# Altium project STM32F4.PrjPCB
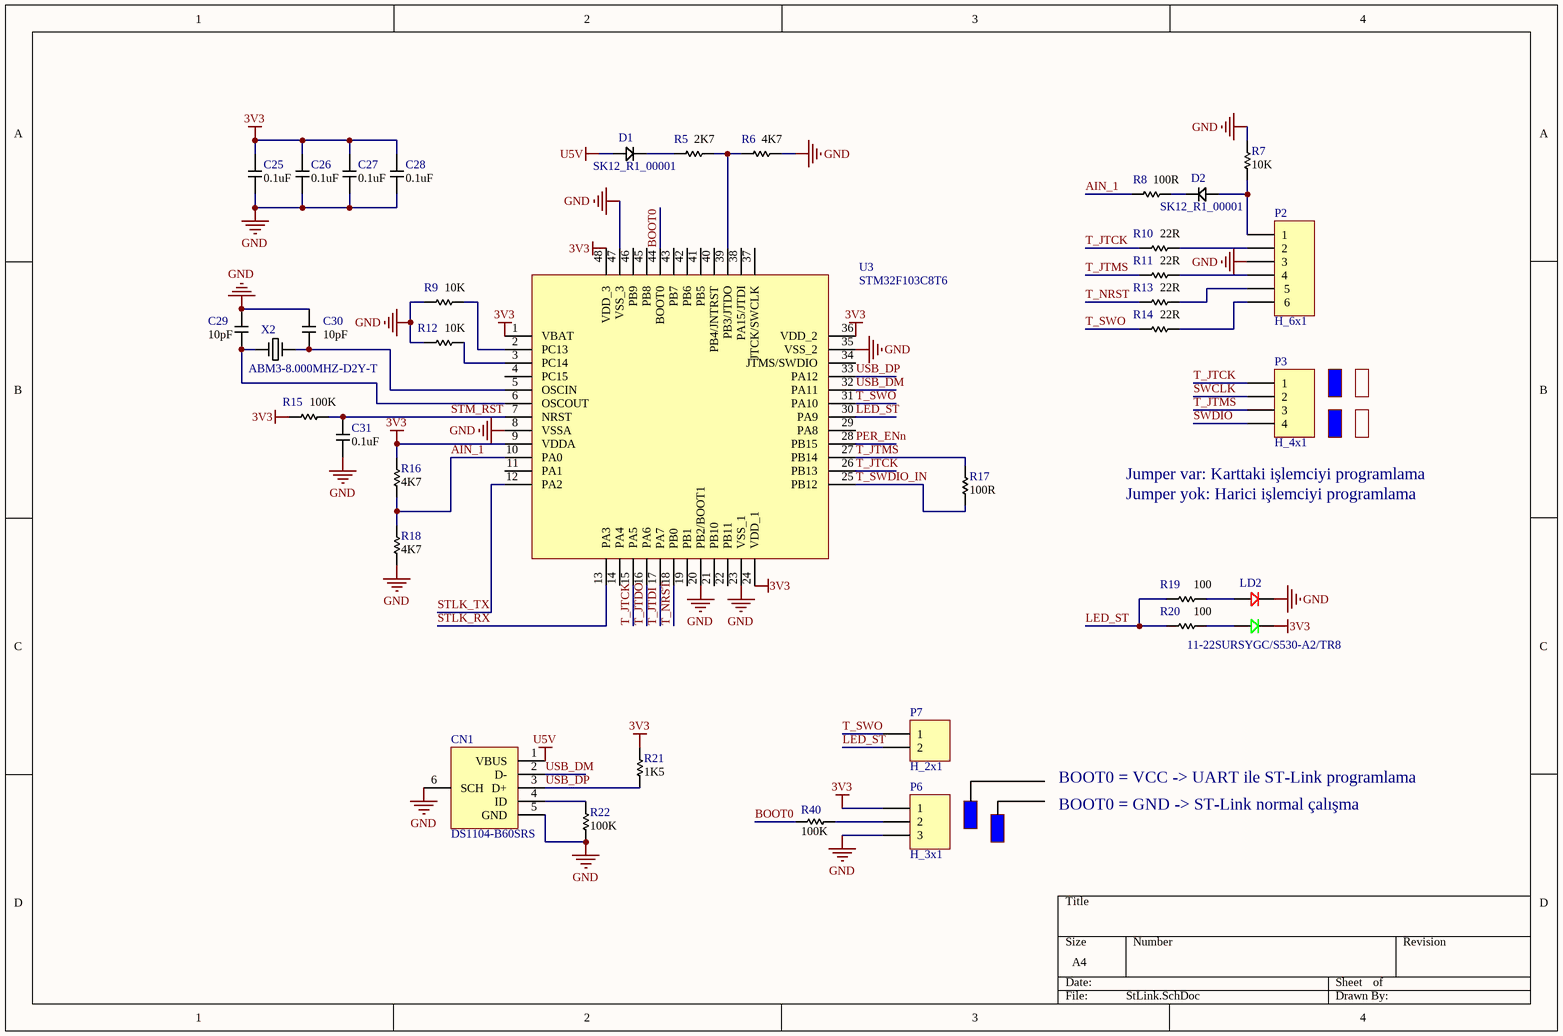
[diagram p0: StLink.SchDoc]
4 sheets, 97 parts. Net scope: global (net labels, ports and power ports of the same name join across sheets).
Board file: PCB.PcbDoc
Sheets:
  StLink.SchDoc
  MCU.SchDoc
  Power.SchDoc
  UserComponents.SchDoc

## Sheet StLink.SchDoc
size A4

### Parts
C25  value 0.1uF  [Kemet_0805_X7R]  (hidden comment: C0805C104K3RACTU)
C26  value 0.1uF  [Kemet_0805_X7R]  (hidden comment: C0805C104K3RACTU)
C27  value 0.1uF  [Kemet_0805_X7R]  (hidden comment: C0805C104K3RACTU)
C28  value 0.1uF  [Kemet_0805_X7R]  (hidden comment: C0805C104K3RACTU)
C29  value 10pF  [Kemet_0805_X7R]  (hidden comment: C0805C104K3RACTU)
C30  value 10pF  [Kemet_0805_X7R]  (hidden comment: C0805C104K3RACTU)
C31  value 0.1uF  [Kemet_0805_X7R]  (hidden comment: C0805C104K3RACTU)
CN1  DS1104-B60SRS  [Connfly_DS1104-B60SRS]
D1  SK12_R1_00001  [Panjit_DO214AA_2]
D2  SK12_R1_00001  [Panjit_DO214AA_2]
LD2  11-22SURSYGC/S530-A2/TR8  [Everlight_11-22SURSYGC]
P2  H_6x1  [HEADER_HDRV6W65P254_6X1_1524X254H945]
P3  H_4x1  [HEADER_HDRV4W65P254_4X1_1016X254H945]
P6  H_3x1  [HEADER_HDRV3W65P254_3X1_762X254H945]
P7  H_2x1  [HEADER_HDRV2W65P254_2X1_508X254H945]
R5  value 2K7  [VISHAY_RESC205X125X50L35_30N]  (hidden comment: CRCW08050000Z0EA)
R6  value 4K7  [VISHAY_RESC205X125X50L35_30N]  (hidden comment: CRCW08050000Z0EA)
R7  value 10K  [VISHAY_RESC205X125X50L35_30N]  (hidden comment: CRCW08050000Z0EA)
R8  value 100R  [VISHAY_RESC205X125X50L35_30N]  (hidden comment: CRCW08050000Z0EA)
R9  value 10K  [VISHAY_RESC205X125X50L35_30N]  (hidden comment: CRCW08050000Z0EA)
R10  value 22R  [VISHAY_RESC205X125X50L35_30N]  (hidden comment: CRCW08050000Z0EA)
R11  value 22R  [VISHAY_RESC205X125X50L35_30N]  (hidden comment: CRCW08050000Z0EA)
R12  value 10K  [VISHAY_RESC205X125X50L35_30N]  (hidden comment: CRCW08050000Z0EA)
R13  value 22R  [VISHAY_RESC205X125X50L35_30N]  (hidden comment: CRCW08050000Z0EA)
R14  value 22R  [VISHAY_RESC205X125X50L35_30N]  (hidden comment: CRCW08050000Z0EA)
R15  value 100K  [VISHAY_RESC205X125X50L35_30N]  (hidden comment: CRCW08050000Z0EA)
R16  value 4K7  [VISHAY_RESC205X125X50L35_30N]  (hidden comment: CRCW08050000Z0EA)
R17  value 100R  [VISHAY_RESC205X125X50L35_30N]  (hidden comment: CRCW08050000Z0EA)
R18  value 4K7  [VISHAY_RESC205X125X50L35_30N]  (hidden comment: CRCW08050000Z0EA)
R19  value 100  [VISHAY_RESC205X125X50L35_30N]  (hidden comment: CRCW08050000Z0EA)
R20  value 100  [VISHAY_RESC205X125X50L35_30N]  (hidden comment: CRCW08050000Z0EA)
R21  value 1K5  [VISHAY_RESC205X125X50L35_30N]  (hidden comment: CRCW08050000Z0EA)
R22  value 100K  [VISHAY_RESC205X125X50L35_30N]  (hidden comment: CRCW08050000Z0EA)
R40  value 100K  [VISHAY_RESC205X125X50L35_30N]  (hidden comment: CRCW08050000Z0EA)
U3  STM32F103C8T6  [STM_QFP48P50_900X900X160L60X22N]
X2  ABM3-8.000MHZ-D2Y-T  [ABRACON_XTALDFN2_500X320X130L130X200N]

### Nets
3V3: C25.2 C26.2 C27.2 C28.2 LD2.4(G-) P6.1 R15.1 R16.2 R21.2 U3.1(VBAT) U3.9(VDDA) U3.24(VDD_1) U3.36(VDD_2) U3.48(VDD_3)
GND: C25.1 C26.1 C27.1 C28.1 C29.2 C30.2 C31.1 CN1.5(GND) CN1.6(SCH) LD2.2(R-) P2.3 P6.3 R6.2 R7.2 R9.1 R12.1 R18.1 R22.2 U3.8(VSSA) U3.20(PB2/BOOT1) U3.23(VSS_1) U3.35(VSS_2) U3.47(VSS_3)
U5V: CN1.1(VBUS) D1.1(A)
AIN_1: R8.2 R16.1 R18.2 U3.10(PA0)
BOOT0: R40.2 U3.44(BOOT0)
LED_ST: P7.2 R19.2 R20.2 U3.30(PA9)
PER_ENn: U3.28(PB15)
STLK_RX: U3.13(PA3)
STLK_TX: U3.12(PA2)
STM_RST: C31.2 R15.2 U3.7(NRST)
SWCLK: P3.2
SWDIO: P3.4
T_JTCK: P3.1 R10.2 U3.15(PA5) U3.26(PB13)
T_JTDI: U3.17(PA7)
T_JTDO: U3.16(PA6)
T_JTMS: P3.3 R11.2 R17.1 U3.27(PB14)
T_NRST: R13.2 U3.18(PB0)  [project net NRST]
T_SWDIO_IN: R17.2 U3.25(PB12)
T_SWO: P7.1 R14.2 U3.31(PA10)
USB_DM: CN1.2(D-) U3.32(PA11)
USB_DP: CN1.3(D+) R21.1 U3.33(PA12)
NetC29_1: C29.1 U3.6(OSCOUT) X2.1
NetC30_1: C30.1 U3.5(OSCIN) X2.2
NetCN1_4: CN1.4(ID) R22.1
NetD1_2: D1.2(C) R5.1
NetD2_1: D2.1(A) P2.1 R7.1
NetD2_2: D2.2(C) R8.1
NetLD2_1: LD2.1(R+) R19.1
NetLD2_3: LD2.3(G+) R20.1
NetP2_2: P2.2 R10.1
NetP2_4: P2.4 R11.1
NetP2_5: P2.5 R13.1
NetP2_6: P2.6 R14.1
NetP6_2: P6.2 R40.1
NetR5_2: R5.2 R6.1 U3.39(PB3/JTDO)
NetR9_2: R9.2 U3.2(PC13)
NetR12_2: R12.2 U3.3(PC14)

Not connected (* = marked no-connect by the designer): U3 4(PC15) 11(PA1) 14(PA4) 19(PB1) 21(PB10) 22(PB11) 29(PA8) 34(JTMS/SWDIO) 37(JTCK/SWCLK) 38(PA15/JTDI) 40(PB4/JNTRST) 41(PB5) 42(PB6) 43(PB7) 45(PB8) 46(PB9)

### Notes on the sheet
- (near P3) Jumper var: Karttaki işlemciyi programlama
- Jumper yok: Harici işlemciyi programlama
- BOOT0 = VCC -> UART ile ST-Link programlama
- BOOT0 = GND -> ST-Link normal çalışma

### Library data of the parts
C25-C31 = C0805C104K3RACTU: Cap_0805_0.1uF_25VDC_Kemet; Manufacturer: Kemet; Voltage: 25VDC; Tolerance: 10%; Dimensions: 2x1.25x0.9; Mounting Type: SMT; Package: 0805; Purchase Link: https://www.ozdisan.com/pasif-komponentler/kondansatorler/smd-kondansatorler-mlcc/C0805C105K4RACTU
CN1 = DS1104-B60SRS: UsbConn_Mini_5Pin_SMT_Connfly
D1 D2 = SK12_R1_00001: Schottky_1A_0.6V_20V_Panjit; Manufacturer: Panjit; Forward Current: 1A; Forward Voltage: 0.6V; Reverse Voltage: 20V; Package: DO214AA; Dimensions: -; Mounting Type: SMD; Purchase Link: https://www.ozdisan.com/guc-yari-iletkenleri/diyot-modul-diyot-dogrultucular/schottky-diyotlar/SK12R100001
LD2 = 11-22SURSYGC/S530-A2/TR8: Led_RG_1.7-2.4V_25mA_Everlight; Forward Current: 25mA; Color: RG; Manufacturer: Everlight; Forward Voltage: 1.7-2.4V; Package: 1206; Dimensions: -; Mounting Type: SMT; Purchase Link: https://www.ozdisan.com/led-led-aydinlatma-cozumleri/led-komponentler/renkli-led-sinyal/11-22SURSYGCS530-A2TR8
P2 = H_6x1: Head_6x1_2.54; Pitch: 2.54mm; Position of Pins: V; Manufacturer: -; Number of Pins: 6x1; Mounting Type: TH; Purchase Link: -; Dimensions: -
P3 = H_4x1: Head_4x1_2.54; Pitch: 2.54mm; Position of Pins: V; Manufacturer: -; Number of Pins: 4x1; Mounting Type: TH; Purchase Link: -; Dimensions: -
P6 = H_3x1: Head_3x1_2.54; Pitch: 2.54mm; Position of Pins: V; Manufacturer: -; Number of Pins: 3x1; Mounting Type: TH; Purchase Link: -; Dimensions: -
P7 = H_2x1: Head_2x1_2.54; Pitch: 2.54mm; Position of Pins: V; Manufacturer: -; Number of Pins: 2x1; Mounting Type: TH; Purchase Link: -; Dimensions: -
R5-R22 R40 = CRCW08050000Z0EA: Res_0805_0R_1/8W_Vishay; Manufacturer: Vishay; Power: 1/8W; Tolerance: Jumper; Dimensions: 2x1.25x0.45; Mounting Type: SMT; Package: 0805; Purchase Link: https://www.ozdisan.com/pasif-komponentler/direncler/smt-smd-direncler/CRCW08050000Z0EA
U3 = STM32F103C8T6: Microcontroller_STM; Manufacturer: STM; Purchase Link: https://ozdisan.com/entegre-devreler-ics/embedded-entegre-devreler/ic-mikroislemciler/STM32F103C8T6; Mounting Type: SMT; Package: LQFP48
X2 = ABM3-8.000MHZ-D2Y-T: Crystal_8MHz_18pF_140R_20PPM_30PPM_Abracon; Load Capacitance: 18pF; ESR: 140R; Frequency Stability: 30PPM; Frequency Tolerance: 20PPM; Frequency: 8MHz; Manufacturer: Abracon; Dimensions: 5x3.2x1.3; Package: ABM3; Mounting Type: SMT; Purchase Link: https://www.ozdisan.com/pasif-komponentler/kristaller-osilatorler-rezanatorler/kristal/ABM3-8-000MHZ-D2Y-T

## Sheet MCU.SchDoc
size A4
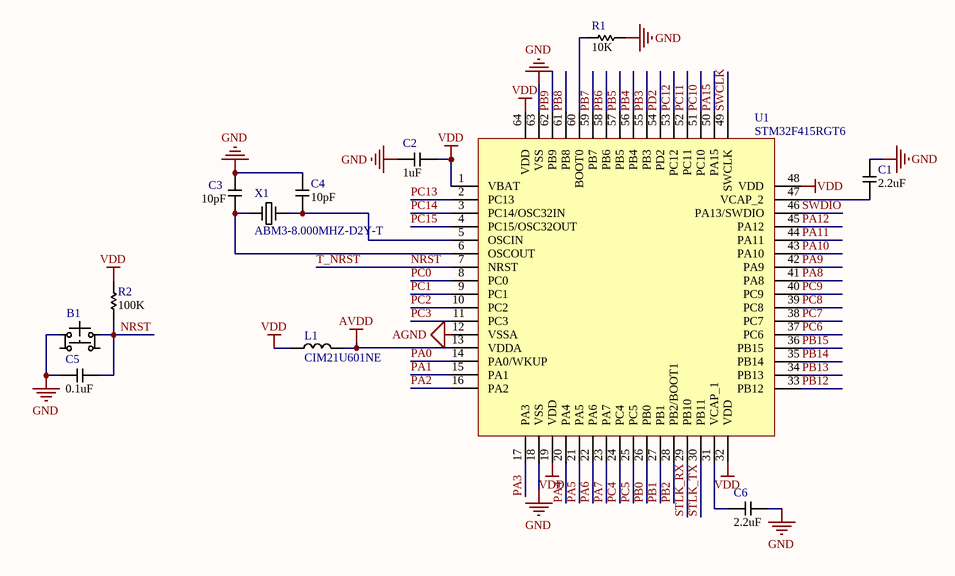
[diagram p1: MCU.SchDoc]

### Parts
B1  DTSM-65R-V-T/R  [Diptronics_DTSM-65_Red_4]  (value not drawn)
C1  value 2.2uF  [Kemet_0805_X7R]  (hidden comment: C0805C104K3RACTU)
C2  value 1uF  [Kemet_0805_X7R]  (hidden comment: C0805C105K4RACTU)
C3  value 10pF  [Kemet_0805_X7R]  (hidden comment: C0805C104K3RACTU)
C4  value 10pF  [Kemet_0805_X7R]  (hidden comment: C0805C104K3RACTU)
C5  value 0.1uF  [Kemet_0805_X7R]  (hidden comment: C0805C104K3RACTU)
C6  value 2.2uF  [Kemet_0805_X7R]  (hidden comment: C0805C104K3RACTU)
L1  CIM21U601NE  [SAMSUNG_INDC200X125X110L45N]
R1  value 10K  [VISHAY_RESC205X125X50L35_30N]  (hidden comment: CRCW08050000Z0EA)
R2  value 100K  [VISHAY_RESC205X125X50L35_30N]  (hidden comment: CRCW08050000Z0EA)
U1  STM32F415RGT6  [STM_QFP64P50_1200X1200X160L60X22N]
X1  ABM3-8.000MHZ-D2Y-T  [ABRACON_XTALDFN2_500X320X130L130X200N]

### Nets
AGND: U1.12(VSSA)
AVDD: L1.2 U1.13(VDDA)
GND: B1.1 C1.1 C2.1 C3.2 C4.2 C5.1 C6.1 R1.1 U1.18(VSS) U1.63(VSS)
VDD: C2.2 L1.1 R2.1 U1.1(VBAT) U1.19(VDD) U1.32(VDD) U1.48(VDD) U1.64(VDD)
NRST: B1.3 C5.2 R2.2 U1.7(NRST)  [also labelled T_NRST]
PA0: U1.14(PA0/WKUP)
PA1: U1.15(PA1)
PA2: U1.16(PA2)
PA3: U1.17(PA3)
PA4: U1.20(PA4)
PA5: U1.21(PA5)
PA6: U1.22(PA6)
PA7: U1.23(PA7)
PA8: U1.41(PA8)
PA9: U1.42(PA9)
PA10: U1.43(PA10)
PA11: U1.44(PA11)
PA12: U1.45(PA12)
PA15: U1.50(PA15)
PB0: U1.26(PB0)
PB1: U1.27(PB1)
PB2: U1.28(PB2/BOOT1)
PB3: U1.55(PB3)
PB4: U1.56(PB4)
PB5: U1.57(PB5)
PB6: U1.58(PB6)
PB7: U1.59(PB7)
PB8: U1.61(PB8)
PB9: U1.62(PB9)
PB12: U1.33(PB12)
PB13: U1.34(PB13)
PB14: U1.35(PB14)
PB15: U1.36(PB15)
PC0: U1.8(PC0)
PC1: U1.9(PC1)
PC2: U1.10(PC2)
PC3: U1.11(PC3)
PC4: U1.24(PC4)
PC5: U1.25(PC5)
PC6: U1.37(PC6)
PC7: U1.38(PC7)
PC8: U1.39(PC8)
PC9: U1.40(PC9)
PC10: U1.51(PC10)
PC11: U1.52(PC11)
PC12: U1.53(PC12)
PC13: U1.2(PC13)
PC14: U1.3(PC14/OSC32IN)
PC15: U1.4(PC15/OSC32OUT)
PD2: U1.54(PD2)
STLK_RX: U1.29(PB10)
STLK_TX: U1.30(PB11)
SWCLK: U1.49(SWCLK)
SWDIO: U1.46(PA13/SWDIO)
NetC1_2: C1.2 U1.47(VCAP_2)
NetC3_1: C3.1 U1.6(OSCOUT) X1.1
NetC4_1: C4.1 U1.5(OSCIN) X1.2
NetC6_2: C6.2 U1.31(VCAP_1)
NetR1_2: R1.2 U1.60(BOOT0)

Not connected (* = marked no-connect by the designer): B1 2 4

### Library data of the parts
B1 = DTSM-65R-V-T/R: Button_SMD_4_6x6x9.5_Diptronics; Dimensions: 6x6x9.5; Mounting Type: SMT; Manufacturer: Diptronics; Purchase Link: https://www.ozdisan.com/elektromekanik-komponentler/sivicler-anahtarlar/tact-sivicler/DTSM-65R-V-TR; Package: DTSM-65; Number of Pins: 4; Color: Red
C1 C3-C6 = C0805C104K3RACTU: as C25 on sheet StLink; Dimensions: 2x1.25x0.9; Mounting Type: SMT; Package: 0805; Purchase Link: https://www.ozdisan.com/pasif-komponentler/kondansatorler/smd-kondansatorler-mlcc/C0805C105K4RACTU
C2 = C0805C105K4RACTU: Cap_0805_1uF_16VDC_Kemet; Manufacturer: Kemet; Voltage: 16VDC; Tolerance: 2%; Dimensions: 2x1.25x0.9; Mounting Type: SMT; Package: 0805; Purchase Link: https://www.ozdisan.com/pasif-komponentler/kondansatorler/smd-kondansatorler-mlcc/C0805C105K4RACTU
L1 = CIM21U601NE: Bead_600R_500mA_0805_Samsung; Manufacturer: Samsung; Mounting Type: SMT; Package: 0805; Purchase Link: https://ozdisan.com/Product/Detail/406952/CIM21U601NE
R1 R2 = CRCW08050000Z0EA: as R5 on sheet StLink; Dimensions: 2x1.25x0.45; Mounting Type: SMT; Package: 0805; Purchase Link: https://www.ozdisan.com/pasif-komponentler/direncler/smt-smd-direncler/CRCW08050000Z0EA
U1 = STM32F415RGT6: Microcontroller_STM; Manufacturer: STM; Package: LQFP64; Mounting Type: SMT; Purchase Link: https://ozdisan.com/Product/Detail/483733/STM32F415RGT6
X1 = ABM3-8.000MHZ-D2Y-T: as X2 on sheet StLink; Manufacturer: Abracon; Dimensions: 5x3.2x1.3; Package: ABM3; Mounting Type: SMT; Purchase Link: https://www.ozdisan.com/pasif-komponentler/kristaller-osilatorler-rezanatorler/kristal/ABM3-8-000MHZ-D2Y-T

## Sheet Power.SchDoc
size A4
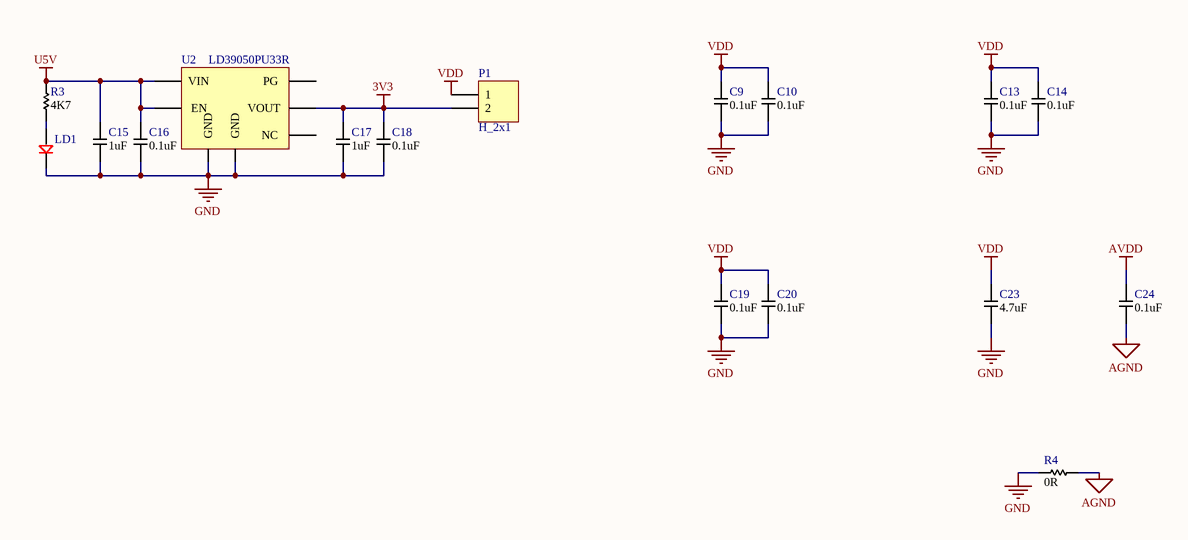
[diagram p2: Power.SchDoc]

### Parts
C9  value 0.1uF  [Kemet_0805_X7R]  (hidden comment: C0805C104K3RACTU)
C10  value 0.1uF  [Kemet_0805_X7R]  (hidden comment: C0805C104K3RACTU)
C13  value 0.1uF  [Kemet_0805_X7R]  (hidden comment: C0805C104K3RACTU)
C14  value 0.1uF  [Kemet_0805_X7R]  (hidden comment: C0805C104K3RACTU)
C15  value 1uF  [Kemet_0805_X7R]  (hidden comment: C0805C105K4RACTU)
C16  value 0.1uF  [Kemet_0805_X7R]  (hidden comment: C0805C104K3RACTU)
C17  value 1uF  [Kemet_0805_X7R]  (hidden comment: C0805C105K4RACTU)
C18  value 0.1uF  [Kemet_0805_X7R]  (hidden comment: C0805C104K3RACTU)
C19  value 0.1uF  [Kemet_0805_X7R]  (hidden comment: C0805C104K3RACTU)
C20  value 0.1uF  [Kemet_0805_X7R]  (hidden comment: C0805C104K3RACTU)
C23  value 4.7uF  [Kemet_0805_X7R]  (hidden comment: C0805C104K3RACTU)
C24  value 0.1uF  [Kemet_0805_X7R]  (hidden comment: C0805C104K3RACTU)
LD1  17-21/R6C-AP1Q2L/3T  [Everlight_17-21]  (value not drawn)
P1  H_2x1  [HEADER_HDRV2W65P254_2X1_508X254H945]
R3  value 4K7  [VISHAY_RESC205X125X50L35_30N]  (hidden comment: CRCW08050000Z0EA)
R4  value 0R  [VISHAY_RESC205X125X50L35_30N]  (hidden comment: CRCW08050000Z0EA)
U2  LD39050PU33R  [TI_SON7P95_300X300X100L40X34T236X162N]

### Nets
3V3: C17.2 C18.2 P1.2 U2.4(VOUT)
AGND: C24.1 R4.1
AVDD: C24.2
GND: C9.1 C10.1 C13.1 C14.1 C15.1 C16.1 C17.1 C18.1 C19.1 C20.1 C23.1 LD1.2(R-) R4.2 U2.2(GND) U2.7(GND)
U5V: C15.2 C16.2 R3.2 U2.1(EN) U2.6(VIN)
VDD: C9.2 C10.2 C13.2 C14.2 C19.2 C20.2 C23.2 P1.1
NetLD1_1: LD1.1(R+) R3.1

Not connected (* = marked no-connect by the designer): U2 3(PG) 5(NC)

### Library data of the parts
C9 C10 C13 C14 C16 C18-C20 C23 C24 = C0805C104K3RACTU: as C25 on sheet StLink; Dimensions: 2x1.25x0.9; Mounting Type: SMT; Package: 0805; Purchase Link: https://www.ozdisan.com/pasif-komponentler/kondansatorler/smd-kondansatorler-mlcc/C0805C105K4RACTU
C15 C17 = C0805C105K4RACTU: as C2 on sheet MCU; Dimensions: 2x1.25x0.9; Mounting Type: SMT; Package: 0805; Purchase Link: https://www.ozdisan.com/pasif-komponentler/kondansatorler/smd-kondansatorler-mlcc/C0805C105K4RACTU
LD1 = 17-21/R6C-AP1Q2L/3T: Led_R_1.7V_25mA_Everlight; Forward Current: 25mA; Forward Voltage: 1.7V; Color: R; Manufacturer: Everlight; Package: 0805; Dimensions: -; Mounting Type: SMT; Purchase Link: https://www.ozdisan.com/led-led-aydinlatma-cozumleri/led-komponentler/renkli-led-sinyal/17-21R6C-AP1Q2L3T
P1 = H_2x1: as P7 on sheet StLink; Manufacturer: -; Number of Pins: 2x1; Mounting Type: TH; Purchase Link: -; Dimensions: -
R3 R4 = CRCW08050000Z0EA: as R5 on sheet StLink; Dimensions: 2x1.25x0.45; Mounting Type: SMT; Package: 0805; Purchase Link: https://www.ozdisan.com/pasif-komponentler/direncler/smt-smd-direncler/CRCW08050000Z0EA
U2 = LD39050PU33R: LinReg_3.3V_500mA_200mV_ST; Manufacturer: ST; Output Voltage: 3.3V; Output Current: 500mA; Dropout Voltage: 200mV; Dimensions: -; Package: DFN6(3x3); Mounting Type: SMT; Purchase Link: https://www.ozdisan.com/entegre-devreler-ics/guc-entegreleri/ic-lineer-voltaj-regulatorleri/LD39050PU33R

## Sheet UserComponents.SchDoc
size A4
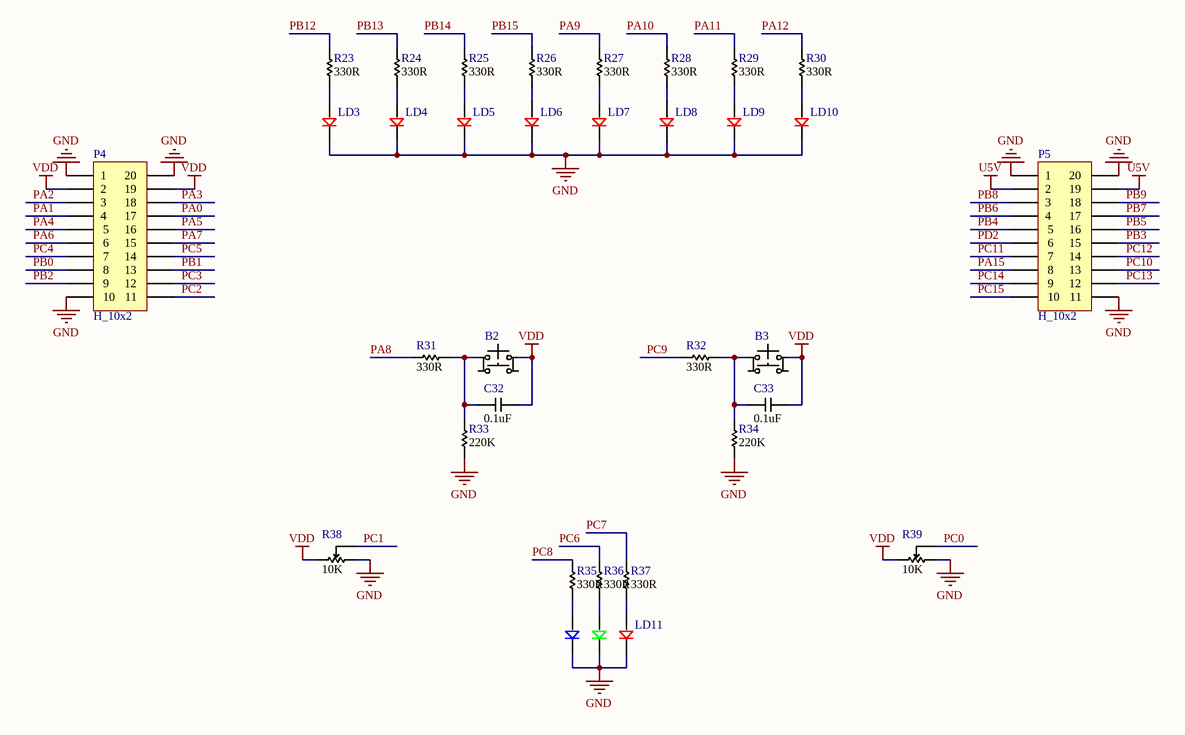
[diagram p3: UserComponents.SchDoc]

### Parts
B2  DTSM-65R-V-T/R  [Diptronics_DTSM-65_Red_4]  (value not drawn)
B3  DTSM-65R-V-T/R  [Diptronics_DTSM-65_Red_4]  (value not drawn)
C32  value 0.1uF  [Kemet_0805_X7R]  (hidden comment: C0805C104K3RACTU)
C33  value 0.1uF  [Kemet_0805_X7R]  (hidden comment: C0805C104K3RACTU)
LD3  17-21/R6C-AP1Q2L/3T  [Everlight_17-21]  (value not drawn)
LD4  17-21/R6C-AP1Q2L/3T  [Everlight_17-21]  (value not drawn)
LD5  17-21/R6C-AP1Q2L/3T  [Everlight_17-21]  (value not drawn)
LD6  17-21/R6C-AP1Q2L/3T  [Everlight_17-21]  (value not drawn)
LD7  17-21/R6C-AP1Q2L/3T  [Everlight_17-21]  (value not drawn)
LD8  17-21/R6C-AP1Q2L/3T  [Everlight_17-21]  (value not drawn)
LD9  17-21/R6C-AP1Q2L/3T  [Everlight_17-21]  (value not drawn)
LD10  17-21/R6C-AP1Q2L/3T  [Everlight_17-21]  (value not drawn)
LD11  HLAF5060H248BS36FU76GCS1  [Honglitronic_5050]  (value not drawn)
P4  H_10x2  [HEADER_HDRV20W65P254_10X2_2540X508H945]
P5  H_10x2  [HEADER_HDRV20W65P254_10X2_2540X508H945]
R23  value 330R  [VISHAY_RESC205X125X50L35_30N]  (hidden comment: CRCW08050000Z0EA)
R24  value 330R  [VISHAY_RESC205X125X50L35_30N]  (hidden comment: CRCW08050000Z0EA)
R25  value 330R  [VISHAY_RESC205X125X50L35_30N]  (hidden comment: CRCW08050000Z0EA)
R26  value 330R  [VISHAY_RESC205X125X50L35_30N]  (hidden comment: CRCW08050000Z0EA)
R27  value 330R  [VISHAY_RESC205X125X50L35_30N]  (hidden comment: CRCW08050000Z0EA)
R28  value 330R  [VISHAY_RESC205X125X50L35_30N]  (hidden comment: CRCW08050000Z0EA)
R29  value 330R  [VISHAY_RESC205X125X50L35_30N]  (hidden comment: CRCW08050000Z0EA)
R30  value 330R  [VISHAY_RESC205X125X50L35_30N]  (hidden comment: CRCW08050000Z0EA)
R31  value 330R  [VISHAY_RESC205X125X50L35_30N]  (hidden comment: CRCW08050000Z0EA)
R32  value 330R  [VISHAY_RESC205X125X50L35_30N]  (hidden comment: CRCW08050000Z0EA)
R33  value 220K  [VISHAY_RESC205X125X50L35_30N]  (hidden comment: CRCW08050000Z0EA)
R34  value 220K  [VISHAY_RESC205X125X50L35_30N]  (hidden comment: CRCW08050000Z0EA)
R35  value 330R  [VISHAY_RESC205X125X50L35_30N]  (hidden comment: CRCW08050000Z0EA)
R36  value 330R  [VISHAY_RESC205X125X50L35_30N]  (hidden comment: CRCW08050000Z0EA)
R37  value 330R  [VISHAY_RESC205X125X50L35_30N]  (hidden comment: CRCW08050000Z0EA)
R38  value 10K  [Bonens_3386F]  (hidden comment: 3386F-1-103LF-BN)
R39  value 10K  [Bonens_3386F]  (hidden comment: 3386F-1-103LF-BN)

### Nets
GND: LD3.2(R-) LD4.2(R-) LD5.2(R-) LD6.2(R-) LD7.2(R-) LD8.2(R-) LD9.2(R-) LD10.2(R-) LD11.4(B-) LD11.5(R-) LD11.6(G-) P4.1 P4.10 P4.20 P5.1 P5.11 P5.20 R33.2 R34.2 R38.3 R39.3
U5V: P5.2 P5.19
VDD: B2.3 B3.3 C32.2 C33.2 P4.2 P4.19 R38.1 R39.1
PA0: P4.17
PA1: P4.4
PA2: P4.3
PA3: P4.18
PA4: P4.5
PA5: P4.16
PA6: P4.6
PA7: P4.15
PA8: R31.1
PA9: R27.2
PA10: R28.2
PA11: R29.2
PA12: R30.2
PA15: P5.8
PB0: P4.8
PB1: P4.13
PB2: P4.9
PB3: P5.15
PB4: P5.5
PB5: P5.16
PB6: P5.4
PB7: P5.17
PB8: P5.3
PB9: P5.18
PB12: R23.2
PB13: R24.2
PB14: R25.2
PB15: R26.2
PC0: R39.2
PC1: R38.2
PC2: P4.11
PC3: P4.12
PC4: P4.7
PC5: P4.14
PC6: R36.2
PC7: R37.2
PC8: R35.2
PC9: R32.1
PC10: P5.13
PC11: P5.7
PC12: P5.14
PC13: P5.12
PC14: P5.9
PC15: P5.10
PD2: P5.6
NetB2_1: B2.1 C32.1 R31.2 R33.1
NetB3_1: B3.1 C33.1 R32.2 R34.1
NetLD3_1: LD3.1(R+) R23.1
NetLD4_1: LD4.1(R+) R24.1
NetLD5_1: LD5.1(R+) R25.1
NetLD6_1: LD6.1(R+) R26.1
NetLD7_1: LD7.1(R+) R27.1
NetLD8_1: LD8.1(R+) R28.1
NetLD9_1: LD9.1(R+) R29.1
NetLD10_1: LD10.1(R+) R30.1
NetLD11_1: LD11.1(G+) R36.1
NetLD11_2: LD11.2(R+) R37.1
NetLD11_3: LD11.3(B+) R35.1

Not connected (* = marked no-connect by the designer): B2 2 4; B3 2 4

### Library data of the parts
B2 B3 = DTSM-65R-V-T/R: Button_SMD_4_6x6x9.5_Diptronics; Dimensions: 6x6x9.5; Mounting Type: SMT; Manufacturer: Diptronics; Purchase Link: https://www.ozdisan.com/elektromekanik-komponentler/sivicler-anahtarlar/tact-sivicler/DTSM-65R-V-TR; Package: DTSM-65; Number of Pins: 4; Color: Red
C32 C33 = C0805C104K3RACTU: as C25 on sheet StLink; Dimensions: 2x1.25x0.9; Mounting Type: SMT; Package: 0805; Purchase Link: https://www.ozdisan.com/pasif-komponentler/kondansatorler/smd-kondansatorler-mlcc/C0805C105K4RACTU
LD3-LD10 = 17-21/R6C-AP1Q2L/3T: as LD1 on sheet Power; Manufacturer: Everlight; Package: 0805; Dimensions: -; Mounting Type: SMT; Purchase Link: https://www.ozdisan.com/led-led-aydinlatma-cozumleri/led-komponentler/renkli-led-sinyal/17-21R6C-AP1Q2L3T
LD11 = HLAF5060H248BS36FU76GCS1: Led_RGB_1.8-2.8-2.8V_3x90mA_Honglitronic; Forward Current: 3x90mA; Color: RGB; Manufacturer: Honglitronic; Forward Voltage: 1.8-2.8-2.8V; Package: 5050; Dimensions: -; Mounting Type: SMT; Purchase Link: https://www.ozdisan.com/led-led-aydinlatma-cozumleri/led-komponentler/renkli-led-aydinlatma/HLAF5060H248BS36FU76GCS1
P4 P5 = H_10x2: Head_10x2_2.54; Pitch: 2.54mm; Position of Pins: V; Manufacturer: -; Number of Pins: 10x2; Mounting Type: TH; Purchase Link: -; Dimensions: -
R23-R37 = CRCW08050000Z0EA: as R5 on sheet StLink; Dimensions: 2x1.25x0.45; Mounting Type: SMT; Package: 0805; Purchase Link: https://www.ozdisan.com/pasif-komponentler/direncler/smt-smd-direncler/CRCW08050000Z0EA
R38 R39 = 3386F-1-103LF-BN: Trimpot_10K_Bonens; Manufacturer: Bonens; Dimensions: 9.5x9.5x5; Mounting Type: TH; Package: 3386F; Power: -; Tolerance: -; Purchase Link: https://www.ozdisan.com/elektromekanik-komponentler/potansiyometre-trimpotlar/trimpot-potansiyometreler/3386F-1-103LF-BN

## Nets that join several sheets
3V3: StLink (14 pins), Power (C17.2 C18.2 P1.2 U2.4)
AGND: MCU (U1.12), Power (C24.1 R4.1)
AVDD: MCU (L1.2 U1.13), Power (C24.2)
GND: StLink (23 pins), MCU (10 pins), Power (15 pins), UserComponents (21 pins)
U5V: StLink (CN1.1 D1.1), Power (5 pins), UserComponents (P5.2 P5.19)
VDD: MCU (8 pins), Power (8 pins), UserComponents (8 pins)
NRST: StLink (R13.2 U3.18), MCU (B1.3 C5.2 R2.2 U1.7)
PA0: MCU (U1.14), UserComponents (P4.17)
PA1: MCU (U1.15), UserComponents (P4.4)
PA2: MCU (U1.16), UserComponents (P4.3)
PA3: MCU (U1.17), UserComponents (P4.18)
PA4: MCU (U1.20), UserComponents (P4.5)
PA5: MCU (U1.21), UserComponents (P4.16)
PA6: MCU (U1.22), UserComponents (P4.6)
PA7: MCU (U1.23), UserComponents (P4.15)
PA8: MCU (U1.41), UserComponents (R31.1)
PA9: MCU (U1.42), UserComponents (R27.2)
PA10: MCU (U1.43), UserComponents (R28.2)
PA11: MCU (U1.44), UserComponents (R29.2)
PA12: MCU (U1.45), UserComponents (R30.2)
PA15: MCU (U1.50), UserComponents (P5.8)
PB0: MCU (U1.26), UserComponents (P4.8)
PB1: MCU (U1.27), UserComponents (P4.13)
PB2: MCU (U1.28), UserComponents (P4.9)
PB3: MCU (U1.55), UserComponents (P5.15)
PB4: MCU (U1.56), UserComponents (P5.5)
PB5: MCU (U1.57), UserComponents (P5.16)
PB6: MCU (U1.58), UserComponents (P5.4)
PB7: MCU (U1.59), UserComponents (P5.17)
PB8: MCU (U1.61), UserComponents (P5.3)
PB9: MCU (U1.62), UserComponents (P5.18)
PB12: MCU (U1.33), UserComponents (R23.2)
PB13: MCU (U1.34), UserComponents (R24.2)
PB14: MCU (U1.35), UserComponents (R25.2)
PB15: MCU (U1.36), UserComponents (R26.2)
PC0: MCU (U1.8), UserComponents (R39.2)
PC1: MCU (U1.9), UserComponents (R38.2)
PC2: MCU (U1.10), UserComponents (P4.11)
PC3: MCU (U1.11), UserComponents (P4.12)
PC4: MCU (U1.24), UserComponents (P4.7)
PC5: MCU (U1.25), UserComponents (P4.14)
PC6: MCU (U1.37), UserComponents (R36.2)
PC7: MCU (U1.38), UserComponents (R37.2)
PC8: MCU (U1.39), UserComponents (R35.2)
PC9: MCU (U1.40), UserComponents (R32.1)
PC10: MCU (U1.51), UserComponents (P5.13)
PC11: MCU (U1.52), UserComponents (P5.7)
PC12: MCU (U1.53), UserComponents (P5.14)
PC13: MCU (U1.2), UserComponents (P5.12)
PC14: MCU (U1.3), UserComponents (P5.9)
PC15: MCU (U1.4), UserComponents (P5.10)
PD2: MCU (U1.54), UserComponents (P5.6)
STLK_RX: StLink (U3.13), MCU (U1.29)
STLK_TX: StLink (U3.12), MCU (U1.30)
SWCLK: StLink (P3.2), MCU (U1.49)
SWDIO: StLink (P3.4), MCU (U1.46)